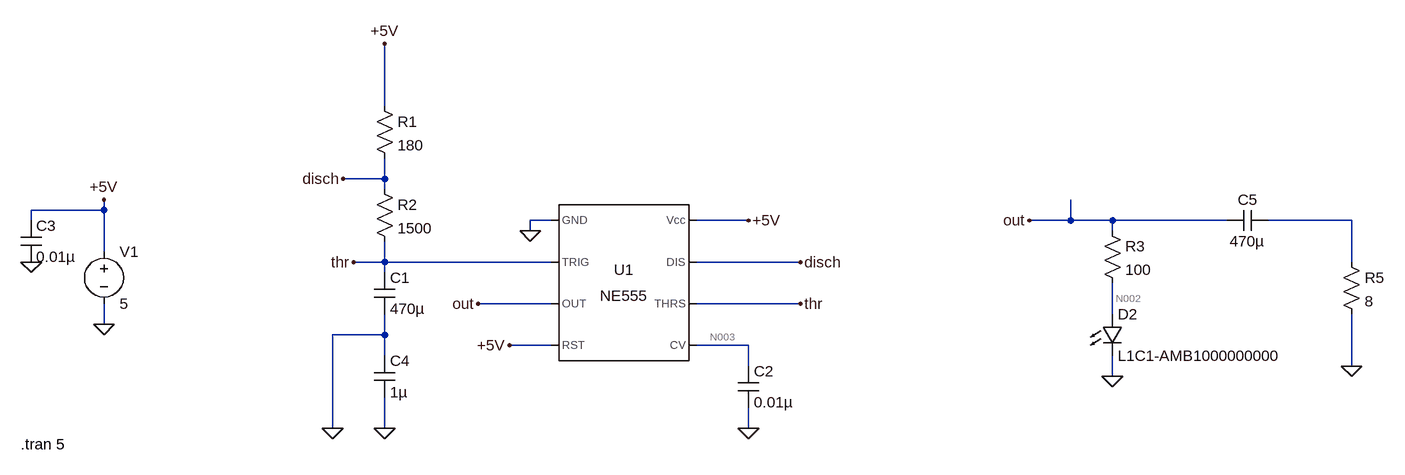
[diagram p0: schematic astable.asc]
astable.asc, the LTspice schematic file:
Version 4.1
SHEET 1 1400 680
WIRE -144 -96 -144 -192
WIRE -144 16 -144 -16
WIRE -144 16 -208 16
WIRE -144 32 -144 16
WIRE -576 64 -576 48
WIRE -576 64 -688 64
WIRE -688 80 -688 64
WIRE 112 80 80 80
WIRE 416 80 336 80
WIRE 912 80 912 48
WIRE 912 80 848 80
WIRE 976 80 912 80
WIRE 1152 80 976 80
WIRE 1344 80 1216 80
WIRE 80 96 80 80
WIRE 976 96 976 80
WIRE -576 128 -576 64
WIRE -144 144 -144 112
WIRE -144 144 -192 144
WIRE 112 144 -144 144
WIRE 496 144 336 144
WIRE 1344 144 1344 80
WIRE -144 160 -144 144
WIRE 112 208 0 208
WIRE 496 208 336 208
WIRE 976 224 976 176
WIRE -576 240 -576 208
WIRE -144 256 -144 224
WIRE -144 256 -224 256
WIRE 112 272 48 272
WIRE 416 272 336 272
WIRE -144 288 -144 256
WIRE 416 304 416 272
WIRE 1344 304 1344 224
WIRE 976 320 976 288
WIRE -224 400 -224 256
WIRE -144 400 -144 352
WIRE 416 400 416 368
FLAG -144 400 0
FLAG -576 240 0
FLAG -576 48 +5V
FLAG -144 -192 +5V
FLAG 416 400 0
FLAG 48 272 +5V
FLAG 0 208 out
FLAG 496 208 thr
FLAG 496 144 disch
FLAG 416 80 +5V
FLAG 80 96 0
FLAG -192 144 thr
FLAG -208 16 disch
FLAG -688 144 0
FLAG 848 80 out
FLAG 976 320 0
FLAG -224 400 0
FLAG 1344 304 0
SYMBOL Misc\\NE555 224 176 R0
SYMATTR InstName U1
SYMBOL res -160 -112 R0
SYMATTR InstName R1
SYMATTR Value 180
SYMBOL res -160 16 R0
SYMATTR InstName R2
SYMATTR Value 1500
SYMBOL cap -160 160 R0
SYMATTR InstName C1
SYMATTR Value 470µ
SYMBOL voltage -576 112 R0
WINDOW 123 0 0 Left 0
WINDOW 39 0 0 Left 0
SYMATTR InstName V1
SYMATTR Value 5
SYMBOL cap 400 304 R0
SYMATTR InstName C2
SYMATTR Value 0.01µ
SYMBOL cap -704 80 R0
SYMATTR InstName C3
SYMATTR Value 0.01µ
SYMBOL res 960 80 R0
SYMATTR InstName R3
SYMATTR Value 100
SYMBOL LED 960 224 R0
SYMATTR InstName D2
SYMATTR Value L1C1-AMB1000000000
SYMBOL cap -160 288 R0
SYMATTR InstName C4
SYMATTR Value 1µ
SYMBOL cap 1152 96 R270
WINDOW 0 32 32 VTop 2
WINDOW 3 0 32 VBottom 2
SYMATTR InstName C5
SYMATTR Value 470µ
SYMBOL res 1328 128 R0
SYMATTR InstName R5
SYMATTR Value 8
TEXT -704 424 Left 2 !.tran 5

The netlist it stands for:
* astable.asc
X§U1 0 thr out +5V N003 thr disch +5V NE555  ; pins GND TRIG OUT RST CV THRS DIS Vcc
R1 +5V disch 180
R2 disch thr 1500
C1 thr 0 470µ
V1 +5V 0 5
C2 N003 0 0.01µ
C3 +5V 0 0.01µ
R3 out N002 100
D2 N002 0 L1C1-AMB1000000000
C4 0 0 1µ
C5 out N001 470µ
R5 N001 0 8
.model D D
.lib standard.dio
.tran 5
.lib NE555.sub
.backanno
.end

* Results of the author's LTspice run, read from the files saved beside the schematic
* Operating Point, zero values left out:
*   V(out) = 4.819 V
*   V(n003) = 3.333 V
*   V(disch) = 5 V
*   V(thr) = 5 V
*   V(+5v) = 5 V
*   V(n002) = 1.805 V
*   I(R1) = 16.67 nA
*   I(D2) = 30.14 mA
*   I(R2) = 10 nA
*   I(V1) = -31.75 mA
*   I(R3) = 30.14 mA
*   Ix(u1:1) = -1.611 mA
*   Ix(u1:2) = 5 nA
*   Ix(u1:3) = -30.14 mA
*   Ix(u1:4) = 22.67 µA
*   Ix(u1:6) = 5 nA
*   Ix(u1:7) = 6.672 nA
*   Ix(u1:8) = 31.73 mA
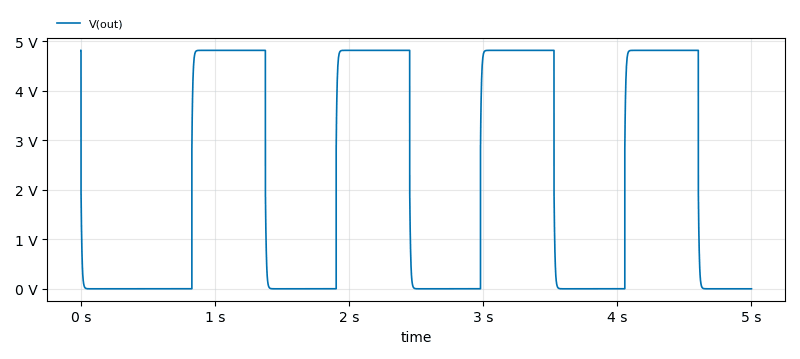
[diagram p1: Transient Analysis of astable.asc, plotted from the saved traces]
* Transient Analysis, 1 run:
*   V(out): min 24.25 µV, max 4.819 V, average 2.116 V, rms 3.179 V, last 30 µV